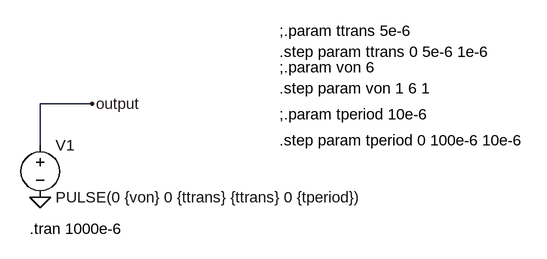
[diagram p0: schematic Noise generator.asc]
Noise generator.asc, the LTspice schematic file:
Version 4
SHEET 1 880 680
WIRE 32 80 -48 80
WIRE -48 144 -48 80
FLAG -48 224 0
FLAG 32 80 output
SYMBOL voltage -48 128 R0
WINDOW 123 0 0 Left 0
WINDOW 39 0 0 Left 0
SYMATTR InstName V1
SYMATTR Value PULSE(0 {von} 0 {ttrans} {ttrans} 0 {tperiod})
TEXT -64 272 Left 2 !.tran 1000e-6
TEXT 320 96 Left 2 !;.param tperiod 10e-6
TEXT 320 136 Left 2 !.step param tperiod 0 100e-6 10e-6
TEXT 320 24 Left 2 !;.param von 6
TEXT 320 56 Left 2 !.step param von 1 6 1
TEXT 320 -32 Left 2 !;.param ttrans 5e-6
TEXT 320 0 Left 2 !.step param ttrans 0 5e-6 1e-6

The netlist it stands for:
* Noise generator.asc
V1 output 0 PULSE(0 {von} 0 {ttrans} {ttrans} 0 {tperiod})
.tran 1000e-6
;.param tperiod 10e-6
.step param tperiod 0 100e-6 10e-6
;.param von 6
.step param von 1 6 1
;.param ttrans 5e-6
.step param ttrans 0 5e-6 1e-6
.backanno
.end